# EAGLE design MirZ21_Sub-D_Renamed_U (EAGLE 9.6.2)
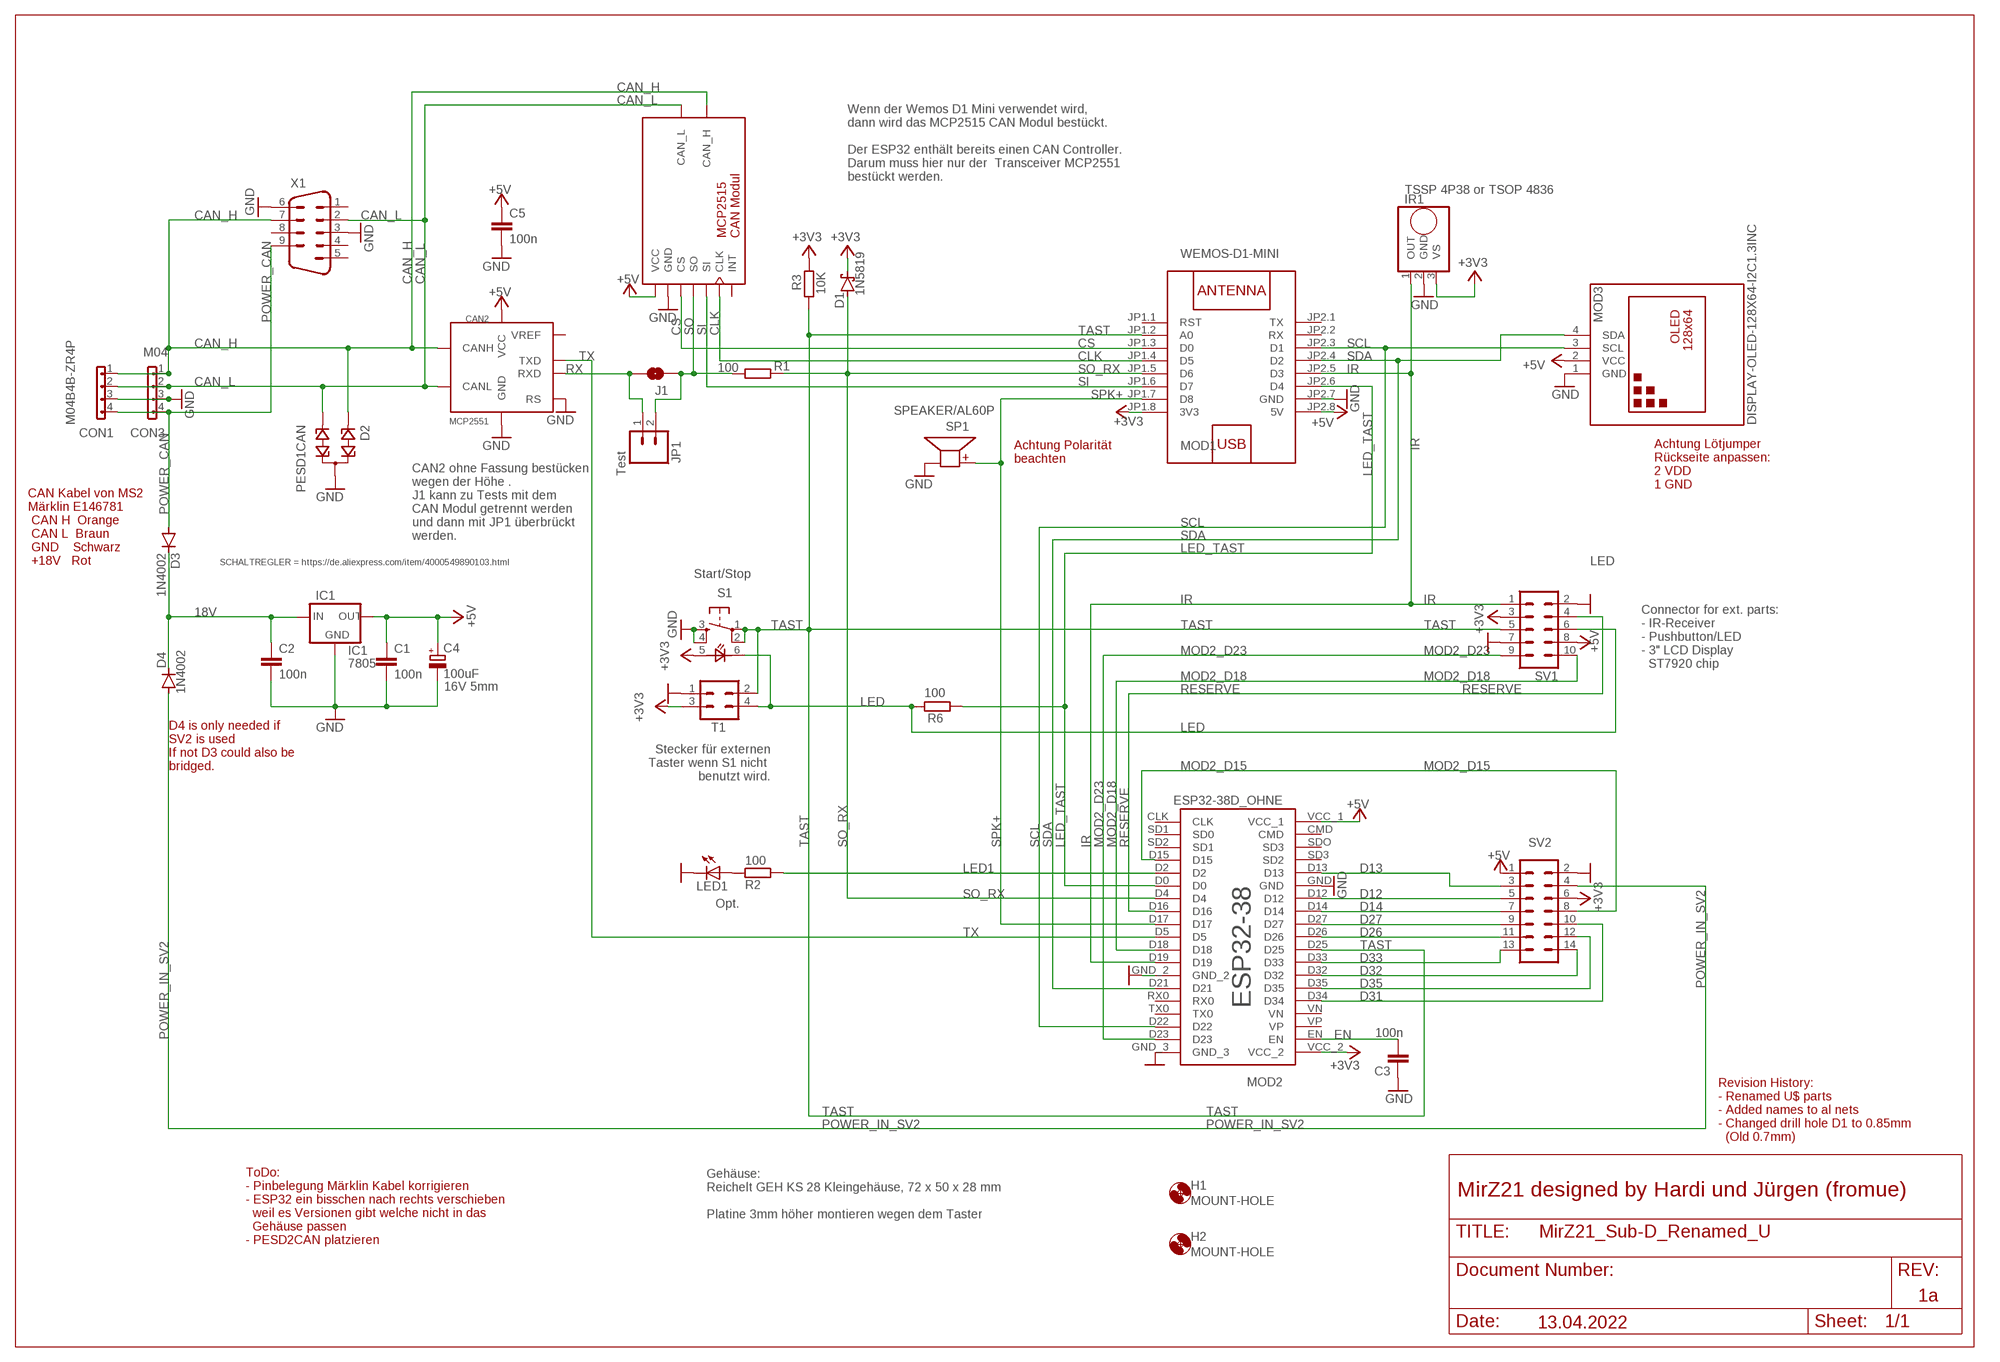
[diagram p0: schematic, sheet 1]

## Parts
C1  100n  C-EU025-025X050  [C025-025X050]
C2  100n  C-EU025-025X050  [C025-025X050]
C3  100n  C-EU025-025X050  [C025-025X050]
C4  100uF  CPOL-EUTT2D5L  [TT2D5L]
C5  100n  C-EU025-025X050  [C025-025X050]
CAN1  MCP2515_CAN_CUTCUT  [MCP2515_CAN_CUT]
CAN2  MCP2551  MCP2551DIP  [DIP08]
CON1  M04B4B-ZR4P  [B4B-ZR4P]
CON3  M04  [1X04]
D1  1N5819  1N581  [DO41-7.6]
D2  PESD1CAN  [SOT23]
D3  1N4002  1N4004  [DO41-10]
D4  1N4002  1N4004  [DO41-10]
H1  MOUNT-HOLE  [GEH_KS]
H2  MOUNT-HOLE  [GEH_KS]
IC1  7805  78XXSSTEPDOWN  [HX1314G]
IR1  TSSP 4P38 or TSOP 4836  TSSP4P38  [TSSP4P38]
J1  SOLDERJUMPERTRACE  [SJ_2S-TRACE]
JP1  Test  M02PTH  [1X02]
LED1  Opt.  LED3MM  [LED3MM]
MOD1  WEMOS-D1-MINI  [WEMOS-D1-MINI]
MOD2  ESP32-38D_OHNE  [ESP32-38D_0]
MOD3  DISPLAY-OLED-128X64-I2C1.3INC  [DISPLAY-OLED-128X64-I2C-1.3]
R1  100  R0204/7  [0204/7]
R2  100  R-EU_0207/2V  [0207/2V]
R3  10K  R0204/7  [0204/7]
R6  100  R0204/7  [0204/7]
S1  TASTER_LEDTC-1198-B  [TASTER_LED]
SP1  SPEAKER/AL60P  [RMP-14SP]
SV1  ML10  [ML10]
SV2  ML14  [ML14]
T1  CON-HARTING-ML_ML4ML4_FEMALE  [ML_ML4_FEMALE]
X1  M09D  [M09D]

## Nets
18V: C2.1 D3.C D4.C IC1.IN
+3V3: D1.C IR1.3(VS) MOD1.JP1.8(3V3) MOD2.VCC_2 R3.2 S1.5(+) SV1.3 SV2.6 T1.3
+5V: C1.1 C4.+ C5.1 CAN1.1(VCC) CAN2.3(VCC) IC1.OUT MOD1.JP2.8(5V) MOD2.VCC_1 MOD3.2(VCC) SV1.8 SV2.1
CAN_H: CAN1.9(CAN_H) CAN2.7(CANH) CON1.1 CON3.1 D2.1 X1.7
CAN_L: CAN1.8(CAN_L) CAN2.6(CANL) CON1.2 CON3.2 D2.2 X1.2
CLK: CAN1.6(CLK) MOD1.JP1.4(D5)
CS: CAN1.3(CS) MOD1.JP1.3(D0)
D12: MOD2.D12 SV2.5
D13: MOD2.D13 SV2.3
D14: MOD2.D14 SV2.7
D26: MOD2.D26 SV2.11
D27: MOD2.D27 SV2.9
D31: MOD2.D34 SV2.10
D32: MOD2.D32 SV2.14
D33: MOD2.D33 SV2.13
D35: MOD2.D35 SV2.12
EN: C3.2 MOD2.EN
GND: C1.2 C2.2 C3.1 C4.- C5.2 CAN1.2(GND) CAN2.2(GND) CAN2.8(RS) CON1.3 CON3.3 D2.3 IC1.GND IR1.2(GND) LED1.K(C) MOD1.JP2.7(GND) MOD2.GND MOD2.GND_2 MOD2.GND_3 MOD3.1(GND) S1.3(S) S1.4(S1) SP1.2(-) SV1.2 SV1.7 SV2.2 T1.1 X1.3 X1.6
IR: IR1.1(OUT) MOD1.JP2.5(D3) MOD2.D19 SV1.1
LED: R6.2 S1.6(-) SV1.6 T1.4
LED1: MOD2.D2 R2.2
LED_TAST: MOD1.JP2.6(D4) MOD2.D0 R6.1
MOD2_D15: MOD2.D15 SV2.8
MOD2_D18: MOD2.D18 SV1.10
MOD2_D23: MOD2.D23 SV1.9
N$10: LED1.A R2.1
POWER_CAN: CON1.4 CON3.4 D3.A X1.9
POWER_IN_SV2: D4.A SV2.4
RESERVE: MOD2.D16 SV1.4
RX: CAN2.4(RXD) J1.2 JP1.1
SCL: MOD1.JP2.3(D1) MOD2.D22 MOD3.3(SCL)
SDA: MOD1.JP2.4(D2) MOD2.D21 MOD3.4(SDA)
SI: CAN1.5(SI) MOD1.JP1.6(D7)
SO: CAN1.4(SO) J1.1 JP1.2 R1.2
SO_RX: D1.A MOD1.JP1.5(D6) MOD2.D4 R1.1
SPK+: MOD1.JP1.7(D8) MOD2.D17 SP1.1(+)
TAST: MOD1.JP1.2(A0) MOD2.D25 R3.1 S1.1(P) S1.2(P1) SV1.5 T1.2
TX: CAN2.1(TXD) MOD2.D5
Unconnected: CAN1.7(INT) MOD1.JP1.1(RST) MOD1.JP2.1(TX) MOD1.JP2.2(RX) MOD2.CLK MOD2.CMD MOD2.RX0 MOD2.SD1(SD0) MOD2.SD2(SD1) MOD2.SD3(SD2) MOD2.SDO(SD3) MOD2.TX0 MOD2.VN MOD2.VP X1.1 X1.4 X1.5 X1.8

## Notes on the sheet
- Wenn der Wemos D1 Mini verwendet wird,
  dann wird das MCP2515 CAN Modul bestückt.
  
  Der ESP32 enthält bereits einen CAN Controller. 
  Darum muss hier nur der  Transceiver MCP2551
  bestückt werden.
- Achtung Polarität
  beachten
- Achtung Lötjumper
  Rückseite anpassen:
  2 VDD
  1 GND
- CAN2 ohne Fassung bestücken
  wegen der Höhe .
  J1 kann zu Tests mit dem 
  CAN Modul getrennt werden
  und dann mit JP1 überbrückt 
  werden.
- CAN Kabel von MS2
  Märklin E146781
   CAN H  Orange   
   CAN L  Braun    
   GND    Schwarz  
   +18V   Rot
- Start/Stop
- IC1
- Connector for ext. parts:
  - IR-Receiver
  - Pushbutton/LED
  - 3" LCD Display 
    ST7920 chip
- Stecker für externen
  Taster wenn S1 nicht 
  benutzt wird.
- D4 is only needed if 
  SV2 is used
  If not D3 could also be 
  bridged.
- Revision History:
  - Renamed U$ parts
  - Added names to al nets
  - Changed drill hole D1 to 0.85mm 
    (Old 0.7mm)
- MirZ21 designed by Hardi und Jürgen (fromue)
- Gehäuse:
  Reichelt GEH KS 28 Kleingehäuse, 72 x 50 x 28 mm
  
  Platine 3mm höher montieren wegen dem Taster
- ToDo:
  - Pinbelegung Märklin Kabel korrigieren
  - ESP32 ein bisschen nach rechts verschieben 
    weil es Versionen gibt welche nicht in das 
    Gehäuse passen
  - PESD2CAN platzieren
- 1a
- 13.04.2022

## Power pins joined to a net without a drawn wire
VREF: CAN2.5(VREF)

## Library data of the parts
C1-C3 C5 = rcl:C-EU: CAPACITOR, European symbol; SPICEPREFIX: C
C4 = resistor:CPOL-EU: POLARIZED CAPACITOR, European symbol; ADD: 16V 5mm
CAN1 = Arduino_fuer_LEDs_DCC_2_All:MCP2515_CAN_CUT: MCP2515 CAN Modul
CAN2 = MLL-Dominik-Hardi:MCP2551
CON1 CON3 = Connectors_Inline3_7:M04
D1 = diode:1N581*: 1.0A SCHOTTKY BARRIER RECTIFIER Source: http://www.diodes.com/datasheets/ds23001.pdf
D2 = diode:PESD1CAN: CAN bus ESD protection diode Source: http://www.nxp.com/documents/data_sheet/PESD1CAN.pdf
D3 D4 = diode:1N4004: DIODE general purpose rectifier, 1 A
H1 H2 = holes:MOUNT-HOLE: MOUNTING HOLE with drill center marker
IC1 = v-reg:78XXS: VOLTAGE REGULATOR; SCHALTREGLER: https://de.aliexpress.com/item/4000549890103.html
IR1 = adafruit:TSSP4P38: TSSP 4P38
J1 = SparkFun-Retired:SOLDERJUMPER: Solder Jumper Standard SMD solder jumper. Used to automate production. Two varients : Normally Open and Normally Closed are the same, but have different paste layers. NC will have a large amount of paste and should jumper during reflow.
JP1 = SparkFun-Connectors:M02: Standard 2-pin 0.1" header. Use with - straight break away headers ( PRT-00116) - right angle break away headers (PRT-00553) - swiss pins (PRT-00743) - machine pins (PRT-00117) - female headers (PRT-00115) Molex polarized connector foot print use with: PRT-08233 with associated crimp pins and housings. 2.54_SCREWTERM for use with PRT-10571. 3.5mm Screw Terminal footprints for PRT-08084 5mm Screw Terminal footprints for use with PRT-08432
LED1 = Arduino_fuer_LEDs_DCC_2:LED: LED OSRAM: - CHIPLED LG R971, LG N971, LY N971, LG Q971, LY Q971, LO R971, LY R971 LH N974, LH R974 LS Q976, LO Q976, LY Q976 LO Q996 - Hyper CHIPLED LW Q18S LB Q993, LB Q99A, LB R99A - SideLED LS A670, LO A670, LY A670, LG A670, LP A670 LB A673, LV A673, LT A673, LW A673 LH A674 LY A675 LS A676, LA A676, LO A676, LY A676, LW A676 LS A679, LY A679, LG A679 - Hyper Micro SIDELED® LS Y876, LA Y876, LO Y876, LY Y876 LT Y87S - SmartLED LW L88C, LW L88S LB L89C, LB L89S, LG L890 LS L89K, LO L89K, LY L89K LS L896, LA L896, LO L896, LY L896 - TOPLED LS T670, LO T670, LY T670, LG T670, LP T670 LSG T670, LSP T670, LSY T670, LOP T670, LYG T670 LG T671, LOG T671, LSG T671 LB T673, LV T673, LT T673, LW T673 LH T674 LS T676, LA T676, LO T676, LY T676, LB T676, LH T676, LSB T676, LW T676 LB T67C, LV T67C, LT T67C, LS T67K, LO T67K, LY T67K, LW E67C LS E67B, LA E67B, LO E67B, LY E67B, LB E67C, LV E67C, LT E67C LW T67C LS T679, LY T679, LG T679 LS T770, LO T770, LY T770, LG T770, LP T770 LB T773, LV T773, LT T773, LW T773 LH T774 LS E675, LA E675, LY E675, LS T675 LS T776, LA T776, LO T776, LY T776, LB T776 LHGB T686 LT T68C, LB T68C - Hyper Mini TOPLED® LB M676 - Mini TOPLED Santana® LG M470 LS M47K, LO M47K, LY M47K Source: http://www.osram.convergy.de LUXEON: - LUMILED® LXK2-PW12-R00, LXK2-PW12-S00, LXK2-PW14-U00, LXK2-PW14-V00 LXK2-PM12-R00, LXK2-PM12-S00, LXK2-PM14-U00 LXK2-PE12-Q00, LXK2-PE12-R00, LXK2-PE12-S00, LXK2-PE14-T00, LXK2-PE14-U00 LXK2-PB12-K00, LXK2-PB12-L00, LXK2-PB12-M00, LXK2-PB14-N00, LXK2-PB14-P00, LXK2-PB14-Q00 LXK2-PR12-L00, LXK2-PR12-M00, LXK2-PR14-Q00, LXK2-PR14-R00 LXK2-PD12-Q00, LXK2-PD12-R00, LXK2-PD12-S00 LXK2-PH12-R00, LXK2-PH12-S00 LXK2-PL12-P00, LXK2-PL12-Q00, LXK2-PL12-R00 Source: www.luxeon.com KINGBRIGHT: KA-3528ASYC Source: www.kingbright.com
MOD1 = diy-modules_modified_by_Hardi:WEMOS-D1-MINI: WEMOS D1 mini: Mini Wi-Fi Board based on ESP-8266 device More details can be found here: https://www.wemos.cc/product/d1-mini.html Click here to find device on ebay.com <http://www.ebay.com/sch/wemos+d1+mini+nodemcu>
MOD2 = MLL-Dominik-Hardi:ESP32-38
MOD3 = diy-modules:DISPLAY-OLED-128X64-I2C: 128x64 Dot Matrix OLED Module based on SSD1306 chip Variant with I2C interface More details available here: http://www.instructables.com/id/Monochrome-096-i2c-OLED-display-with-arduino-SSD13/ SSD1306 datasheet: https://cdn-shop.adafruit.com/datasheets/SSD1306.pdf Click here to find device on ebay.com <http://www.ebay.com/sch/oled+display+128x64+iic> Note: There are two variants: I2C and SPI. Search for the proper version.
R1 R3 R6 = Arduino_fuer_LEDs_DCC_2:R: RESISTOR, European symbol; SPICEMODEL: NONE; SPICEPREFIX: R
R2 = rcl:R-EU_: RESISTOR, European symbol; SPICEPREFIX: R
S1 = switch-omron:TASTER_LED: OMRON SWITCH; ALI: https://de.aliexpress.com/item/4000415375387.html; ELV: 091576 EAN 4023392915765
SP1 = adafruit:SPEAKER: SPEAKER Source: Buerklin Added PS12 (for part # PS1240 piezo) http://www.ladyada.net/library/pcb/eaglelibrary.html
SV1 = con-harting-ml:ML10: HARTING; OC_FARNELL: unknown; OC_NEWARK: unknown
SV2 = Arduino_fuer_LEDs_DCC_2:ML14: HARTING; OC_FARNELL: unknown; OC_NEWARK: unknown
T1 = RGB-LED-Verteiler:CON-HARTING-ML_ML4
X1 = con-subd:M09: SUB-D; OC_FARNELL: unknown; OC_NEWARK: unknown

## Board
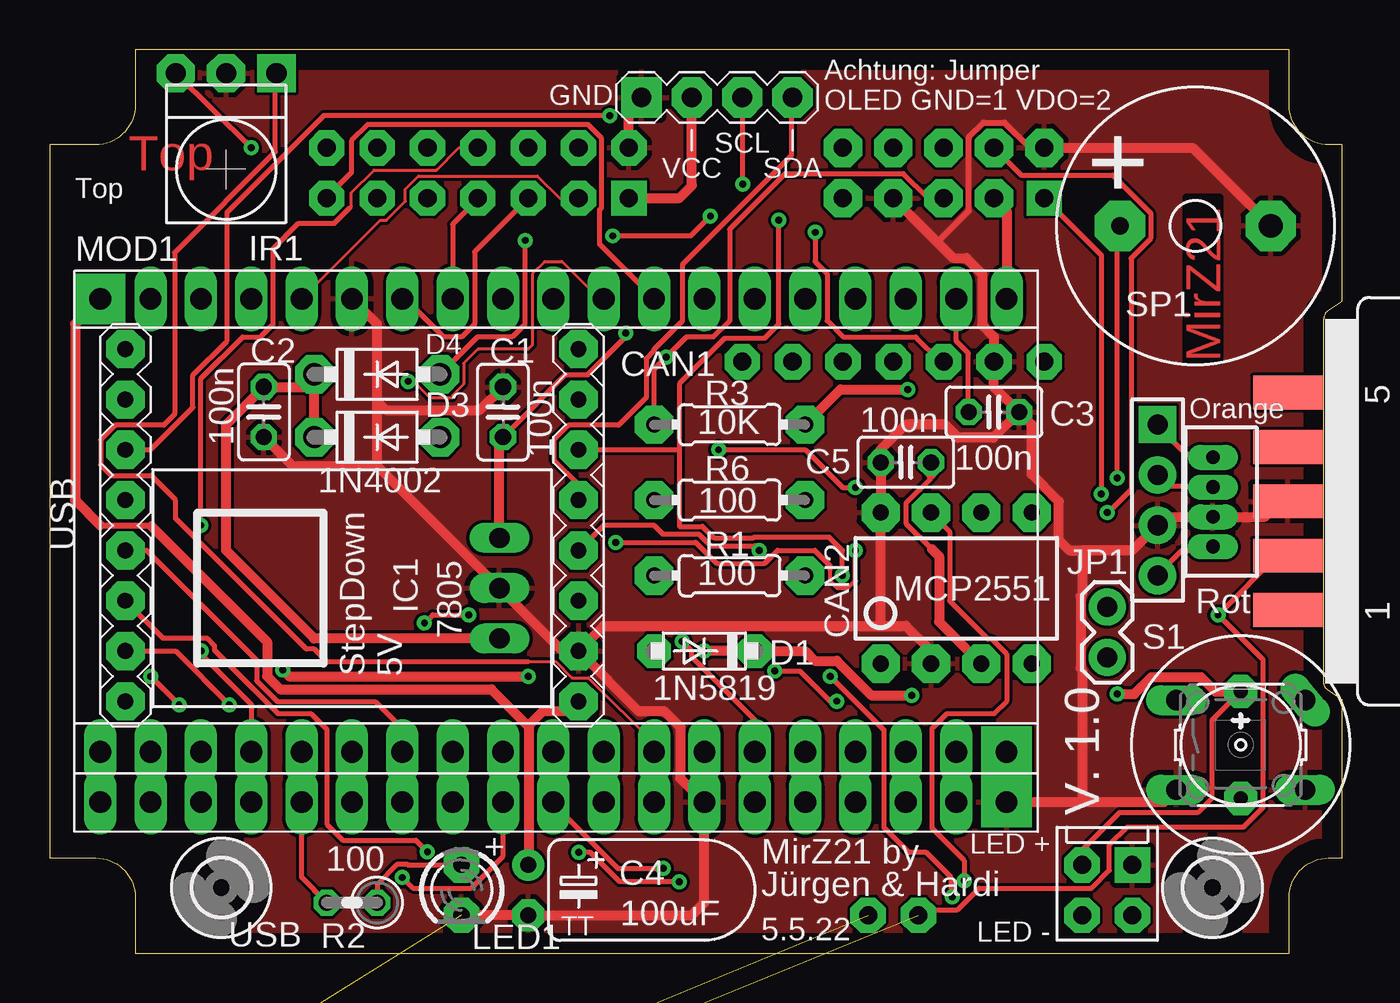
[diagram p1: board, top side]
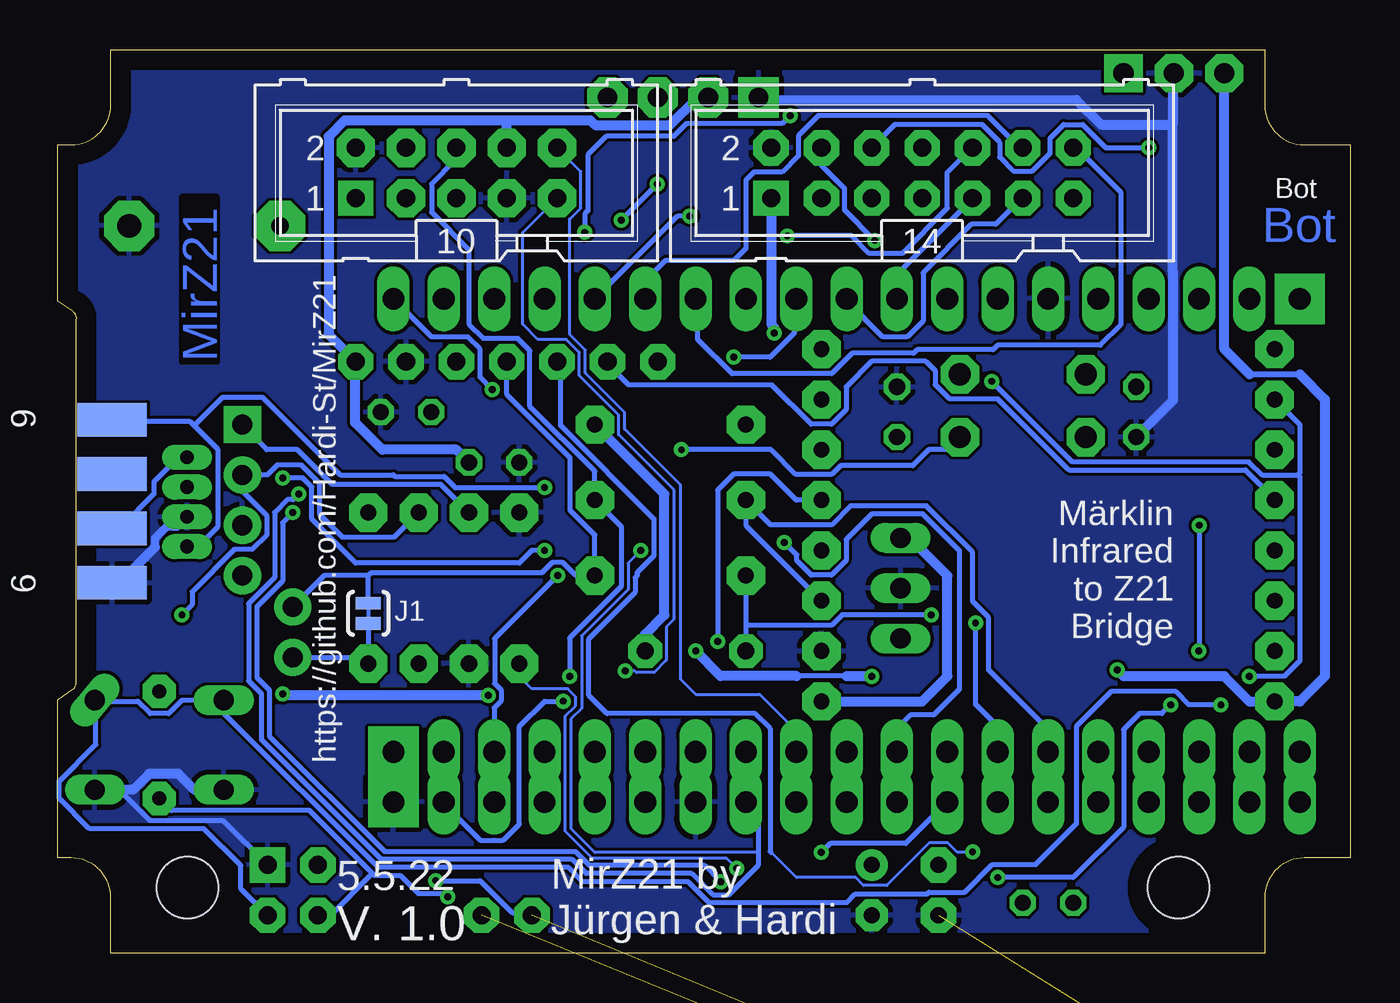
[diagram p2: board, bottom side, seen from below]

Size 65.22 x 45.6 mm. Coordinates in mm from the lower left corner, seen from the top.
Outline: 62.53,0 62.53,2.8 arc-90 64.53,4.8 65.22,4.8 65.22,12.78 64.45,13.29 arc-50 64.28,13.68 64.28,32 arc-50 64.45,32.39 65.22,32.9 65.22,40.8 64.53,40.8 arc-90 62.53,42.8 62.53,45.6 4.33,45.6 4.33,42.8 arc-90 2.33,40.8 0,40.8 0,4.8 2.33,4.8 arc-90 4.33,2.8 4.33,0 62.53,0
Copper layers (1*16): Top 0.035mm / dielectric 1.5mm / Bottom 0.035mm
Design rules "default *": minimum track width 6mil, minimum drill 0.35mm, track to track 6mil, track to pad 6mil, pad to pad 6mil, via to via 6mil, smd to smd 6mil, copper to edge 40mil, drill to drill 6mil, minimum pad ring 10mil, minimum via ring 8mil, stop-mask expansion 4mil, vias tented up to drill 0.4mm, thermal gap 10mil

### Footprints (pad centres in the part's own frame; a part is rotated, then mirrored left to right if it is on the bottom)
C025-025X050 = drill 0.813 octagon: 1 -1.27,0; 2 1.27,0
TT2D5L = drill 0.813 pad 1.6: + -1.27,0 | drill 0.813 pad 1.6 octagon: - 1.27,0
MCP2515_CAN_CUT = drill 0.914 pad 1.778 octagon: 1 0,0; 2 0,-2.54; 3 0,-5.08; 4 0,-7.62; 5 0,-10.16; 6 0,-12.7; 7 0,-15.24; 8 27.94,-6.35; 9 27.94,-8.89
DIP08 = drill 0.813 pad 1.93 octagon: 1 -3.81,-3.81; 2 -1.27,-3.81; 3 1.27,-3.81; 4 3.81,-3.81; 5 3.81,3.81; 6 1.27,3.81; 7 -1.27,3.81; 8 -3.81,3.81
B4B-ZR4P = drill 0.7 pad 1.27 long: 1 0,0; 2 1.5,0; 3 3,0; 4 4.5,0
1X04 = drill 1.016 pad 1.88 square: 1 0,0 | drill 1.016 pad 1.88: 2 2.54,0; 3 5.08,0; 4 7.62,0
DO41-7.6 = drill 0.85 pad 1.7 octagon: A 2.54,0; C -2.54,0
SOT23 = smd 1 x 1.4: 1 -0.95,-1.1; 2 0.95,-1.1; 3 0,1.1
DO41-10 = drill 1.118 pad 1.93 octagon: A 3.175,0; C -3.175,0
GEH_KS = hole 3.1: 0,0
HX1314G = drill 1.016 long: GND 0,0; IN -2.54,0; OUT 2.54,0
TSSP4P38 = drill 1.016 pad 1.93 square: 1 -2.54,0 | drill 1.016 pad 1.93 octagon: 2 0,0; 3 2.54,0
SJ_2S-TRACE = smd 0.635 x 1.27: 1 -0.508,0; 2 0.508,0
1X02 = drill 1.016 pad 1.88: 1 0,0; 2 2.54,0
LED3MM = drill 0.813 pad 1.778 octagon: A -1.27,0; K 1.27,0
WEMOS-D1-MINI = drill 0.8 pad 1.93 octagon: JP1.1 -11.43,9.525; JP1.2 -11.43,6.985; JP1.3 -11.43,4.445; JP1.4 -11.43,1.905; JP1.5 -11.43,-0.635; JP1.6 -11.43,-3.175; JP1.7 -11.43,-5.715; JP1.8 -11.43,-8.255; JP2.1 11.43,9.525; JP2.2 11.43,6.985; JP2.3 11.43,4.445; JP2.4 11.43,1.905; JP2.5 11.43,-0.635; JP2.6 11.43,-3.175; JP2.7 11.43,-5.715; JP2.8 11.43,-8.255
ESP32-38D_0 = drill 1.1 pad 1.45 long: CLK 25.4,0; CLK-1 22.86,0; D0 25.4,12.7; D0-1 22.86,12.7; D2 25.4,10.16; D2-0 22.86,10.16; D4 25.4,15.24; D4-1 22.86,15.24; D5 25.4,22.86; D5-1 22.86,22.86; D12 0,15.24; D13 0,10.16; D14 0,17.78; D15 25.4,7.62; D15-1 22.86,7.62; D16 25.4,17.78; D16-1 22.86,17.78; D17 25.4,20.32; D17-1 22.86,20.32; D18 25.4,25.4; D18-1 22.86,25.4; D19 25.4,27.94; D19-1 22.86,27.94; D21 25.4,33.02; D21-1 22.86,33.02; D22 25.4,40.64; D22-1 22.86,40.64; D23 25.4,43.18; D23-1 22.86,43.18; D25 0,25.4; D26 0,22.86; D27 0,20.32; D32 0,30.48; D33 0,27.94; D34 0,35.56; D35 0,33.02; EN 0,43.18; GND 0,12.7; GND_2 25.4,30.48; GND_2-1 22.86,30.48; RX0 25.4,35.56; RX0-1 22.86,35.56; SD0-1 22.86,2.54; SD1 25.4,5.08; SD1-1 22.86,5.08; SD2 0,7.62; SD3 0,5.08; SDO 25.4,2.54; TX0 25.4,38.1; TX0-1 22.86,38.1; VCC_2 0,45.72; VN 0,38.1; VP 0,40.64 | drill 1.1 pad 1.27 long: CMD 0,2.54 | drill 1.1 pad 2.54 square: GND_3 25.4,45.72; GND_3-1 22.86,45.72; VCC_1 0,0
DISPLAY-OLED-128X64-I2C-1.3 = drill 1 pad 2.032 square: 1 -3.81,12.7 | drill 1 pad 2.032 octagon: 2 -1.27,12.7; 3 1.27,12.7; 4 3.81,12.7
0204/7 = drill 0.813 pad 1.93 octagon: 1 -3.81,0; 2 3.81,0
0207/2V = drill 0.813 octagon: 1 -1.27,0; 2 1.27,0
TASTER_LED = drill 1.016 long: 1 -3.251,2.261; 2 3.251,2.261; 3 -3.251,-2.261; 4 3.251,-2.261 | drill 0.7 pad 1.676 octagon: 5 0,2.7; 6 0,-2.7
RMP-14SP = drill 0.9 pad 2.54 octagon: 1 -3.8,0 | drill 1.2 pad 2.54 octagon: 2 3.8,0
ML10 = drill 0.914 pad 1.778 square: 1 -5.08,-1.27 | drill 0.914 pad 1.93 octagon: 2 -5.08,1.27; 3 -2.54,-1.27; 4 -2.54,1.27; 5 0,-1.27; 6 0,1.27; 7 2.54,-1.27; 8 2.54,1.27; 9 5.08,-1.27; 10 5.08,1.27
ML14 = drill 0.914 pad 1.778 square: 1 -7.62,-1.27 | drill 0.914 pad 1.778 octagon: 2 -7.62,1.27; 3 -5.08,-1.27; 4 -5.08,1.27; 5 -2.54,-1.27; 6 -2.54,1.27; 7 0,-1.27; 8 0,1.27; 9 2.54,-1.27; 10 2.54,1.27; 11 5.08,-1.27; 12 5.08,1.27; 13 7.62,-1.27; 14 7.62,1.27
ML_ML4_FEMALE = drill 0.914 pad 1.778 square: 1 -2.54,-1.27 | drill 0.914 pad 1.778 octagon: 2 -2.54,1.27; 3 0,-1.27; 4 0,1.27
M09D = smd 1.7 x 3.5: 1 5.486,-6.045; 2 2.743,-6.045; 3 0,-6.045; 4 -2.743,-6.045; 5 -5.486,-6.045 | smd 1.7 x 3.5 bottom: 6 4.115,-6.045; 7 1.372,-6.045; 8 -1.372,-6.045; 9 -4.115,-6.045

### Placement (x,y rotation side)
C1  22.88,27.3 90 top
C2  10.81,27.3 270 top
C3  47.64,27.3 180 top
C4  24.14,3.17 270 top
C5  43.2,24.77 180 top
CAN1  50.18,29.84 270 top
CAN2  45.73,18.41 0 top
CON1  58.69,25.02 270 top
CON3  55.9,26.67 270 top
D1  33.04,15.24 180 top
D2  -10.98,-19 0 top  (outside the outline)
D3  16.53,26.04 0 top
D4  16.53,29.21 0 top
H1  8.67,3.3 0 top
H2  58.66,3.3 0 top
IC1  22.7,18.41 90 top
IR1  8.91,44.4 180 top
J1  49.55,17.14 270 bottom
JP1  53.36,14.92 90 top
LED1  20.78,3.17 270 top
MOD1  15.26,20.95 0 top
MOD2  2.56,33.02 270 top
MOD3  33.67,30.48 0 top
R1  34.3,19.05 0 top
R2  15.26,2.54 180 top
R3  34.3,26.67 0 top
R6  34.3,22.86 0 top
S1  60.09,10.5 0 top
SP1  57.8,36.7 0 top
SV1  45.1,39.37 0 bottom
SV2  21.61,39.37 0 bottom
T1  52.09,3.17 180 top
X1  68.52,22.8 270 top

### Tracks (layer width: path | path; a pad name or v marks a point on that pad's centre or on a via)
18V
  Top 0.508: D3.C 13.35,28.61 | 13.35,28.61 D4.C | 13.35,28.61 13.31,28.57 C2.1 8.91,26.67 8.91,20.32 13.35,15.88 IC1.IN
+3V3  (via drill 0.35)
  Top 0.254: v10.18,40.64 IR1.3 | S1.5 58.64,11.75 58.64,7.81 57.92,7.09 53.97,7.09 52.09,5.2 T1.3
  Top 0.508: SV1.3 48.27,37.47 MOD2.VCC_2 | v33.04,15.24 D1.C 38.12,15.24 38.6,14.76 39.71,14.76 41.46,13.01 v43.5,13.01 | R3.2 39.89,28.45 v43.3,28.45 | v11.76,14.29 12.08,13.97 v24.14,13.97 | v53.87,13.07 54.73,13.07 55.59,13.93 58.08,13.93 58.81,13.2 S1.5
  Bottom 0.254: MOD2.VCC_2 46.34,31.09 44.52,31.09 43.91,30.48 43.91,29.06 v43.3,28.45 | v10.18,40.64 12.33,40.64 13.5,41.81 14.47,41.81 15.15,41.12 15.15,40.36 16.04,39.47 17.01,39.47 17.69,40.16 17.69,40.92 18.58,41.81 22.98,41.81 SV2.6 | 25.43,13.98 27.96,13.98
  Bottom 0.305: 5.09,29.21 2.56,29.21
  Bottom 0.508: v33.04,15.24 31.78,13.98 27.96,13.98 | v24.14,13.97 25.41,13.97 25.43,13.98 | D1.C 35.58,16.08 34.61,17.05 34.61,23.16 R3.2 | v11.76,14.29 11.45,13.97 6.36,13.97 5.09,12.7 MOD1.JP1.8 2.56,12.7 1.28,13.97 1.28,27.94 2.56,29.21 | v53.87,13.07 53.8,13.01 v43.5,13.01 | 5.09,29.21 6.36,30.48 IR1.3
+5V  (via drill 0.35)
  Top 0.254: 46.95,14.63 CAN2.3 | 23.19,26.35 26.03,29.18 27.15,29.18 29.07,31.11 v29.07,31.29 | 44.47,24.13 44.47,23.98 43.22,22.74 43.22,21.67 44.52,20.37
  Top 0.305: 5.15,21.54 5.09,21.59 2.56,21.59
  Top 0.508: 24.18,11.49 24.91,12.22 26.2,12.22 MOD1.JP2.8 | 24.18,11.49 24.11,11.49 22.29,13.31 11.63,13.31 10.98,13.96 10.98,15.71 5.15,21.54 | 23.19,26.35 C1.1 22.7,25.86 IC1.OUT | 44.47,24.13 C5.1 | 44.52,20.37 44.87,20.02 44.87,16.71 46.95,14.63 | C4.+ 24.18,4.48 24.18,11.49 | SV2.1 31.77,38.1 32.4,38.73 MOD3.2 | MOD2.VCC_1 1.28,31.75 1.28,22.86 2.56,21.59
  Bottom 0.254: 50.2,29.87 CAN1.1
  Bottom 0.508: MOD1.JP2.8 21.61,12.7 20.34,13.97 20.34,19.05 22.24,20.95 IC1.OUT | v29.07,31.29 29.07,31.57 29.19,31.68 29.19,38.06 SV2.1 | MOD3.2 32.93,43.18 34.35,41.76 38.07,41.76 38.32,42.01 42.6,42.01 | 42.6,42.01 50.75,42.01 51.55,41.21 51.55,31.22 50.2,29.87 50.2,26.77 48.84,25.4 45.1,25.4 C5.1 | SV1.8 42.56,41.97 42.6,42.01
CAN_H  (via drill 0.35)  (1 unrouted)
  Top 0.254: CON1.1 58.54,25.2 57.32,25.2 55.9,26.62 CON3.1 | v46.14,3.66 46.14,4.67 44.52,6.3 44.52,11.33 45.28,12.09 47.66,12.09 48.27,12.7 48.27,15.1 47.52,15.85 47.34,15.85 45.41,17.78 45.41,21.26 44.52,22.15 CAN2.7
  Bottom 0.254: CON3.1 55.9,26.62 54.68,25.4 53.12,25.4 51.37,23.65 45.89,23.65 CAN2.7 | X1.7 62.4,21.54 61.99,21.54 60.37,23.16 60.37,23.77 59.15,24.99 58.74,24.99 CON1.1 | v46.14,3.66 43.91,3.66 42.28,2.03 41.47,2.03 CAN1.9
CAN_L  (via drill 0.35)  (1 unrouted)
  Top 0.254: CON1.2 58.54,23.57 56.3,23.57 55.9,23.98 CON3.2 | 61.99,20.12 62.4,20.12 X1.2 61.99,20.12 | 61.99,20.12 v58.94,17.07 61.2,14.81 61.2,7.34 60.22,6.35 54.36,6.35 53.46,5.45 53.46,4.16 52.57,3.28 46.89,3.28 45.8,2.19 44.11,2.19 CAN1.8
  Bottom 0.254: v58.94,17.07 58.44,17.58 58.44,18.23 56.3,20.37 55.39,20.37 54.68,21.09 54.68,22.09 55.9,23.31 CON3.2 54.64,24.13 54.13,24.64 52.93,24.64 51.99,23.69 51.99,22.13 50.84,20.98 48.25,20.98 CAN2.6
CLK
  Bottom 0.254: MOD1.JP1.4 3.88,22.96 5.3,24.38 14.2,24.38 17.79,27.96 20.22,27.96 20.95,28.69 20.95,29.39 21.43,29.87 24.14,29.87 25.44,28.57 25.44,27.42 26.17,26.7 27.2,26.7 29.18,28.68 36.41,28.68 37.4,29.67 CAN1.6
CS  (via drill 0.35)
  Top 0.254: CAN1.3 44.92,29.87 43.7,31.09 40.05,31.09 39.22,31.92 39.22,34.3 38.62,34.9 v38.62,36.37 | v28.26,42.27 13.83,42.27 8.96,37.39 8.96,30.89 7.23,29.16 7.23,27.53 5.09,25.4 MOD1.JP1.3
  Bottom 0.254: v28.26,42.27 28.67,41.86 33.49,41.86 34.13,41.22 37.53,41.22 38.47,40.28 38.47,37.46 38.62,37.31 v38.62,36.37
D12
  Top 0.254: SV2.5 21.44,35.39 21.44,31.74 20.79,31.09 19.88,31.09 17.95,33.02 MOD2.D12
D13
  Top 0.152: MOD2.D13 16.68,36.98 16.99,36.98 17.95,37.94 17.95,38.56 18.6,39.22 24.61,39.22 25.73,38.1 SV2.3
D14
  Top 0.254: MOD2.D14 20.34,36.78 21.55,38 SV2.7
D26
  Bottom 0.254: MOD2.D26 25.41,32.92 23.59,31.09 22.37,31.09 21.55,31.9 21.55,34.34 19.12,36.78 17.9,36.78 16.68,38 SV2.11
D27
  Bottom 0.254: MOD2.D27 22.77,33.12 22.77,34.34 19.12,38 SV2.9
D31  (via drill 0.35)
  Top 0.254: v28.4,36.2 32.35,36.2 v33.34,37.19
  Bottom 0.254: MOD2.D34 33.95,37.19 v33.34,37.19 | SV2.10 19.12,40.64 20.34,39.42 20.34,37.59 22.62,35.31 24.27,35.31 25.15,36.2 v28.4,36.2
D32
  Bottom 0.254: MOD2.D32 32.93,32.92 32.93,30.97 31.2,29.23 26.17,29.23 25.13,30.28 22.03,30.28 21.85,30.45 18.02,30.45 17.8,30.68 12.61,30.68 11.6,31.7 11.6,38.41 13.83,40.64 SV2.14
D33
  Top 0.254: SV2.13 14.04,38.2 15.23,39.4 15.23,41 16.04,41.81 27.17,41.81 27.85,41.12 27.85,37.62 27.74,37.51 27.74,35.77 MOD2.D33
D35
  Bottom 0.254: MOD2.D35 35.58,33.93 34.56,34.95 31.11,34.95 30.5,35.56 30.5,39.01 30.09,39.42 28.67,39.42 27.85,40.23 27.85,41.25 26.84,42.27 18.3,42.27 16.68,40.64 SV2.12
EN
  Top 0.254: MOD2.EN 45.73,30.89 46.34,30.28 46.34,27.43 C3.2
GND  (1 unrouted)
  Top 0.254: 62.24,22.96 62.4,22.96 X1.3
  Top 0.305: 44.78,35.88 46.37,37.47 46.37,41.17 47.11,41.91 48.17,41.91 49.44,40.64 SV1.2
  Top 0.508: MOD1.JP2.7 25.87,15.24 IC1.GND 16.53,24.59 | MOD1.JP2.7 29.71,12.22 31,12.22 31.8,11.42 31.8,8.82 32.52,8.1 32.55,8.1 MOD2.GND_2 33.04,2.54 32.4,1.91 C4.- LED1.K | MOD2.GND 16.53,31.75 16.53,27.84 | 16.53,24.59 16.53,27.84 | C2.2 12.26,24.59 16.53,24.59 | CAN2.2 44.47,15.24 43.2,16.51 41.92,16.51 | 41.92,16.51 CAN2.8 C5.2 41.92,25.4 43.2,26.67 45.17,26.67 45.83,26.01 47.62,26.01 C3.1 | MOD1.JP2.7 27.96,16.51 41.92,16.51 | C3.1 47.64,28.57 CAN1.2 47.64,31.09 47.04,31.68 47.04,34.28 46.24,35.08 45.58,35.08 44.78,35.88 SV1.7 | SV2.2 29.23,42.55 MOD3.1 | C3.1 49.55,26.67 49.55,24.16 50.92,22.79 50.92,20.85 51.45,20.32 52.09,20.32 | 62.24,22.96 61.3,22.02 CON1.3 56.32,22.02 CON3.3 54.62,20.32 52.09,20.32 | SV1.2 57.66,40.64 SP1.2 | 16.53,27.84 16.96,27.41 21.71,27.41 C1.2 | MOD2.GND_3 52.09,7.62 | 52.09,7.62 56.22,7.62 S1.3 | 52.09,20.32 52.09,18.1 52.01,18.02 52.01,14.37 52.09,14.29 52.09,7.62
  Bottom 0.254: S1.4 62.11,8.24 60.55,6.68 56.86,6.68 T1.1
  Bottom 0.406: CON1.3 59.2,21.51 59.73,21.51 60.31,20.93 60.31,20.48
  Bottom 0.508: 8.96,41.86 8.96,34.37 8.94,34.35 8.94,27.9 C2.2 | IR1.2 8.96,44.4 8.96,41.86 | MOD3.1 29.73,43.05 13.82,43.05 12.58,41.81 9.01,41.81 8.96,41.86 | 60.31,20.48 62.11,18.68 X1.6 | S1.3 58.31,8.24 59.12,9.04 60.6,9.04 61.41,8.24 S1.4
  pour Bottom: 0.01,40.64 5.09,45.72 62.24,45.72 62.24,43.18 66.06,39.37 66.06,5.08 66.06,3.81 62.24,0 2.56,0 0.01,2.54
  pour Top: 0.01,45.72 67.33,45.72 67.33,0 0.01,0
IR  (via drill 0.35)
  Top 0.152: 24.14,14.71 25.53,14.71 26.34,13.89 27.18,13.89 30.5,10.58
  Top 0.254: 30.5,10.58 MOD2.D19 | IR1.1 11.39,44.35 11.39,40.44 6.31,35.36 6.31,27.19 5.76,26.64 3.31,26.64 2.58,25.92 2.58,24.64 3.11,24.11 5.12,24.11 6.36,22.86 6.36,21.93 12.95,15.34 13.35,15.34 13.99,14.71 24.14,14.71 | v35.8,20.32 35.57,20.55 33.35,20.55 32.77,21.13 30.95,21.13 30.5,21.59 27.96,21.59 MOD1.JP2.5 | SV1.1 53.05,35.23 v53.05,23.16
  Bottom 0.152: 29.89,5.08 38.12,5.08 39.3,6.26 39.3,11.84 38.78,12.36 38.78,16 36.44,18.34 36.44,19.68 v35.8,20.32
  Bottom 0.254: MOD2.D19 30.5,7.52 29.89,6.91 29.89,5.08 29.89,4.42 31.36,2.95 32.17,2.95 33.24,4.01 38.56,4.01 39.27,4.72 48.89,4.72 54.94,10.78 54.94,13.1 55.58,13.74 55.58,17.64 54.27,18.95 54.27,22.24 53.63,22.88 53.33,22.88 v53.05,23.16
LED  (via drill 0.35)
  Top 0.254: v39.38,13.97 42.09,11.26 42.09,6.34 43.35,5.08 44.21,5.08 45.48,3.81 45.48,2.89 v45.53,2.85
  Bottom 0.254: SV1.6 45.12,40.64 45.12,40.03 46.34,38.81 46.34,37.39 44.47,35.51 44.47,31.75 43.73,31.01 42,31.01 41.39,30.4 41.39,27.59 38.12,24.32 R6.2 36.79,21.54 36.79,18.49 39.38,15.9 v39.38,13.97 | v45.53,2.85 45.69,3 47.01,3 47.91,3.91 49.22,3.91 49.34,4.02 | S1.6 59.48,7.2 52.51,7.2 49.34,4.02 | T1.4 51.45,1.91 49.34,4.02
LED1
  Top 0.254: R2.2 12.71,3.81 MOD2.D2
LED_TAST
  Bottom 0.254: MOD2.D0 15.26,7.72 15.41,7.87 15.41,11.43 18.25,14.28 18.25,16.93 19.07,17.75 19.07,20.23 21.4,22.57 25.22,22.57 26.17,21.61 29.25,21.61 R6.1 30.5,21.59 MOD1.JP2.6
MOD2_D15  (via drill 0.35)
  Top 0.152: SV2.8 20.65,40.64 19.53,39.52 16.37,39.52 15.23,38.38 15.23,37.69 15.15,37.62
  Top 0.254: v7.63,21.59 7.63,28.99 9.74,31.09 10.63,31.09 11.28,31.74 11.28,35.56 12.55,36.83 14.37,36.83 15.15,37.62 | v7.66,15.24 7.66,15.06 10.18,12.55 MOD2.D15
  Bottom 0.254: v7.63,21.59 7.63,15.24 v7.66,15.24
MOD2_D18
  Bottom 0.152: SV1.10 38.83,39.45 38.83,37.61 39.38,37.05 39.38,31.22 38.6,30.43 38.6,29.27 36.62,27.29 36.62,26.44 33.82,23.64 33.82,13.84 33.04,13.06 29.81,13.06 27.96,11.21 MOD2.D18
MOD2_D23  (via drill 0.35)
  Top 0.254: v39.71,12.71 39.37,12.71 37.85,14.23 v36.58,14.23
  Bottom 0.152: SV1.9 41.76,36.36 41.76,31.74 40.98,30.96 39.56,30.96 38.9,30.31 38.9,29.15 36.92,27.16 36.92,26.16 34.12,23.36 34.12,16.85 34.5,16.48 34.5,14.79 34.56,14.73 35.13,14.16 36.02,14.16 36.09,14.23 v36.58,14.23
  Bottom 0.254: MOD2.D23 45.73,7.52 43.91,5.69 43.2,5.69 43.19,5.69 42.74,5.69 41.92,6.5 41.92,11.43 40.64,12.71 v39.71,12.71
N$10
  Top 0.254: LED1.A 18.09,4.45 18.07,4.47 17.52,4.47 16.53,3.47 R2.1
POWER_CAN  (via drill 0.35)
  Top 0.254: CON1.4 58.54,20.32 57.11,20.32 55.9,19.1 CON3.4 | v33.75,25.4 38.12,25.4 40.02,23.5 v40.66,23.5
  Bottom 0.254: 58.33,26.62 57.11,25.4 57.11,21.54 58.13,20.52 58.54,20.52 CON1.4 | 58.33,26.62 58.54,26.82 62.4,26.82 X1.9 | 58.33,26.62 56.91,28.04 54.88,28.04 50.97,24.13 48.27,24.13 48.2,24.05 45.72,24.05 45.16,23.5 v40.66,23.5 | D3.A 20.34,25.4 21.28,25.4 22.08,24.6 25.72,24.6 26.17,24.16 27.98,24.16 29.23,25.4 v33.75,25.4
POWER_IN_SV2  (via drill 0.35)
  Top 0.254: v23.99,35.97 23.99,31.75 23.33,31.09 21.58,31.09 D4.A
  Bottom 0.254: v23.99,35.97 25.52,37.49 25.52,38.58 26.69,39.75 SV2.4
RESERVE  (via drill 0.35)
  Top 0.254: v26.69,5.08 27.28,5.08 28.75,3.6 v31.77,3.6 | SV1.4 49.01,39.27 53.63,39.27 55.55,37.34 55.55,36.06 54.56,35.07 54.56,23.39 53.4,22.23 v53.36,22.23
  Bottom 0.254: v31.77,3.6 32.58,4.42 38.39,4.42 39.1,5.13 48.72,5.13 54.54,10.95 54.54,13.27 55.17,13.91 55.17,17.48 53.86,18.78 53.86,21.72 v53.36,22.23 | MOD2.D16 22.43,5.52 26.24,5.52 v26.69,5.08
RX
  Bottom 0.254: J1.2 CAN2.4 49.86,14.92 JP1.1
SCL  (via drill 0.35)
  Top 0.254: v34.97,38.81 34.97,43.08 MOD3.3 | v36.79,36.98 36.79,31.75 36.06,31.01 34.04,31.01 31.77,28.74 31.77,25.4 | 31.77,25.4 31.77,21.54 32.93,21.54 33.52,20.95 35.5,20.95 35.52,20.98 39.34,20.98 40,20.32 v40,19.05 | MOD1.JP2.3 31.77,25.4
  Bottom 0.254: v36.79,36.98 v34.97,38.81 | MOD2.D22 43.2,12.38 42.84,12.73 42.84,13.28 43.17,13.61 43.17,15.88 v40,19.05
SDA  (via drill 0.35)
  Top 0.254: MOD3.4 37.4,43.08 37.4,40.23 31.92,34.75 31.92,31.9 30.5,30.48 30.5,30.39 30.09,29.99 30.09,28.02 28.71,26.64 26.17,26.64 25.44,25.92 25.44,24.88 26.69,23.64 MOD1.JP2.4 | v31.92,15.72 32.38,15.27 32.38,14.97 35.58,11.77 MOD2.D21
  Bottom 0.254: v31.92,15.72 31.92,23.37 31.11,24.18 29.28,24.18 27.96,22.86 MOD1.JP2.4
SI  (via drill 0.35)
  Top 0.254: v19.07,5.1 18.48,5.69 14.8,5.69 13.99,6.5 13.99,11.28 13.17,12.09 11.52,12.09 8.32,15.3 8.32,15.51 7.93,15.9 5.71,15.9 MOD1.JP1.6
  Bottom 0.152: v19.07,5.1 19.86,5.1 20.32,5.56 21.24,5.56 23.39,3.42 24.57,3.42 24.96,3.81 27.96,3.81 29.23,5.08
  Bottom 0.254: CAN1.5 39.84,29.67 39.84,26.62 35.14,21.91 35.14,20.05 35.98,19.2 35.98,19.05 36.08,18.95 36.08,18.2 38.42,15.86 38.42,13.01 37.5,12.09 30.04,12.09 29.28,11.33 29.28,5.13 29.23,5.08
SO
  Bottom 0.254: CAN1.4 42.56,28.19 39.36,24.99 39.36,22.34 38.12,21.1 R1.2 39.07,19.05 39.73,19.71 40.27,19.71 40.79,19.19 49.41,19.19 49.55,19.05 | J1.1 49.55,19.05 | 49.55,19.05 51.77,19.05 JP1.2
SO_RX  (via drill 0.35)
  Top 0.254: MOD1.JP1.5 4.89,20.32 10.45,14.77 10.45,13.74 11.49,12.7 16.42,12.7 17.95,11.18 17.95,7.77 MOD2.D4 | v21.15,17.07 19.32,17.07 v18.91,16.66
  Bottom 0.254: R1.1 30.5,16.66 | 30.5,16.66 D1.A | v18.91,16.66 18.91,12.55 17.8,11.43 MOD2.D4 | v21.15,17.07 25.64,17.07 26.17,16.54 30.37,16.54 30.5,16.66
SPK+  (via drill 0.35)
  Top 0.203: 40.66,18.78 40.62,18.78 40.26,18.42 39.74,18.42 39.36,18.79 39.36,19.34
  Top 0.254: v53.86,23.98 53.86,36.58 SP1.1 | 40.66,18.78 v40.66,20.32 | MOD2.D17 22.88,4.89 21.26,3.28 18.33,3.28 v17.8,3.81 | v28.56,20.73 32.6,20.73 33.66,19.66 36.07,19.66 36.73,20.32 38.61,20.32 39.36,19.57 39.36,19.34 | MOD1.JP1.7 6.36,15.24 v9.07,12.53
  Bottom 0.254: v53.86,23.98 52.85,23.98 52.39,23.52 52.39,21.9 50.18,19.68 41.92,19.68 41.29,20.32 v40.66,20.32 | MOD2.D17 23.03,7.77 23.03,11.18 22.19,12.01 21.02,12.01 19.73,13.31 19.73,20.32 21.56,22.16 24.14,22.16 25.44,20.86 25.44,19.8 26.17,19.07 27.2,19.07 27.93,19.8 27.93,20.09 v28.56,20.73 | v9.07,12.53 9.52,12.09 10.63,12.09 11.45,11.28 11.45,6.35 13.99,3.81 v17.8,3.81
TAST  (via drill 0.35)
  Top 0.152: v18.1,28.85 18.37,28.85 19.21,28.02 20.34,28.02 20.34,28.16 20.89,28.72 20.89,29.77 21.61,30.48 24.14,30.48 24.36,30.7 24.36,34.28 24.98,34.9 25.85,34.9 27.73,33.02 MOD2.D25
  Top 0.254: SV1.5 44.32,38.1 43.08,39.34 37.12,39.34 34.3,36.52 34.3,31.9 33.49,31.09 32.12,31.09 v31.11,30.07 30.5,29.46 R3.1 | v5.09,13.97 v6.53,12.53
  Bottom 0.254: v18.1,28.85 14.04,24.79 5.12,24.79 4.46,24.13 2.66,24.13 | v31.11,30.07 29.28,30.07 28.06,31.29 28.06,32.92 MOD2.D25 | v6.53,12.53 8.14,12.53 8.8,13.19 12.07,13.19 13.82,11.44 13.82,6.52 15.87,4.47 18.07,4.47 19.46,3.07 21.26,3.07 21.35,2.98 24.97,2.98 25.41,2.54 32.34,2.54 33.41,3.61 38.73,3.61 39.43,4.32 49.05,4.32 56.84,12.1 S1.1 58.95,12.76 59.62,12.08 60.55,12.08 61.17,12.71 63.29,12.71 | S1.2 63.29,12.71 | T1.2 55.97,3.25 55.97,4.42 57.83,6.28 63.61,6.28 65.14,7.81 65.14,8.67 63.29,10.53 63.29,12.71 | 2.66,24.13 2.56,24.23 2.56,26.67 MOD1.JP1.2 | 2.66,24.13 2.56,24.03 2.56,14.75 3.33,13.97 v5.09,13.97
TX  (via drill 0.35)
  Top 0.254: MOD2.D5 25.41,7.52 28.66,4.28 v30.96,4.28
  Bottom 0.152: CAN2.1 41.92,13.97 41.29,13.34 39.48,13.34 39.46,13.32 39.11,12.96 39.11,12.46 39.6,11.96 39.6,6.13 38.24,4.78 31.46,4.78 v30.96,4.28

### Text on the board
Top: Top | MirZ21
Bottom: Bot | MirZ21
tPlace: Achtung: Jumper / OLED GND=1 VDO=2 | Top | Orange | USB | Rot | StepDown / 5V | LED + | + | MirZ21 by / Jürgen & Hardi | USB | LED -
bPlace: Bot | https://github.com/Hardi-St/MirZ21 | Märklin / Infrared / to Z21 / Bridge | MirZ21 by / Jürgen & Hardi
Measures: Gehäuse außen | Bohrung / SUB-D | Ausschnitt / Sub-D | Bohrung / SUB-D | Ausschnitt / Sub-D | Optionale LED | Maße in mm | Taster Bohrung / 6.1 - 6.2mm